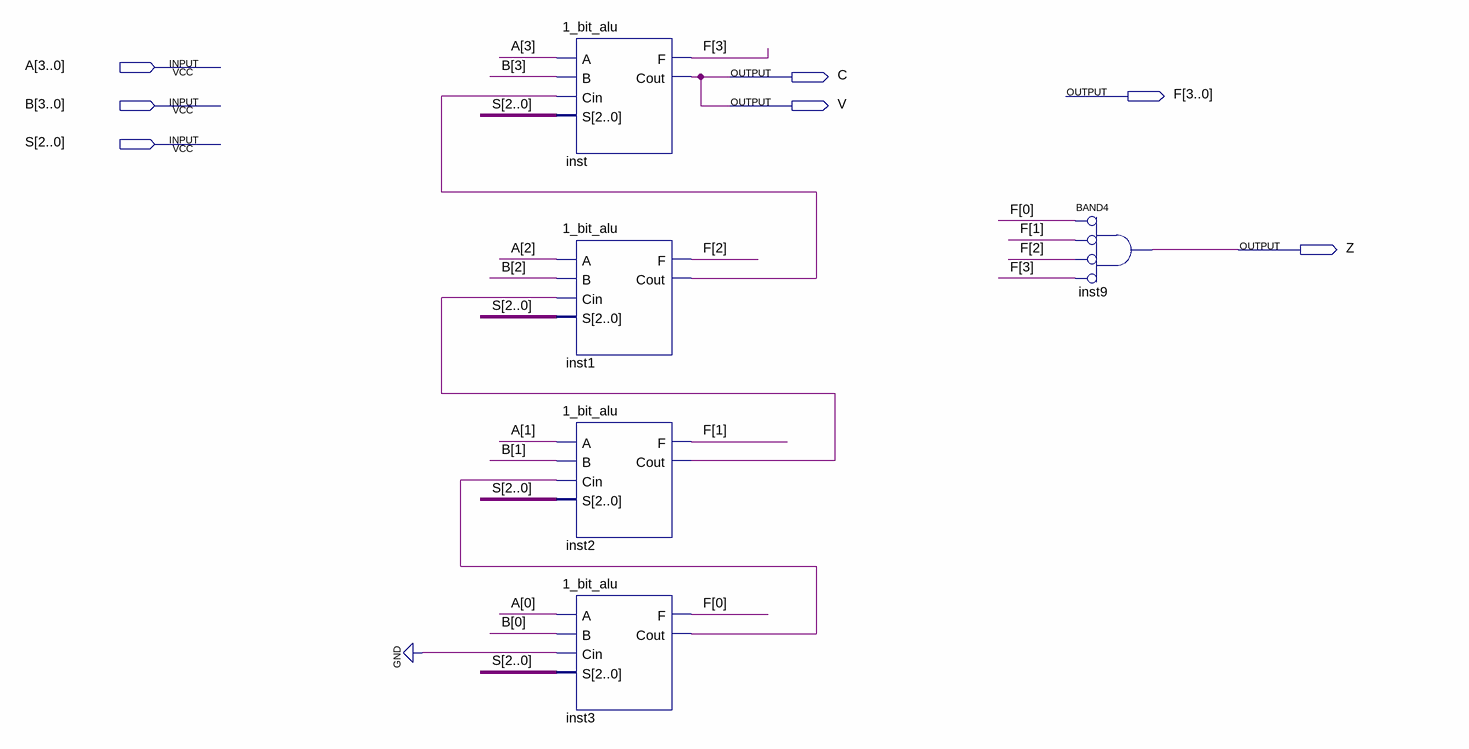
[diagram p0: schematic sheet]
// Quartus schematic alu_4bit.bdf as structural Verilog: 5 symbols, 7 pins
module alu_4bit (
  input  [3:0] A,
  input  [3:0] B,
  input  [2:0] S,
  output C,
  output [3:0] F,
  output V,
  output Z
);

  wire inst1_cout, inst2_cout, inst3_cout;

  \1_bit_alu  inst (.A(A[3]), .B(B[3]), .Cin(inst1_cout), .S(S), .F(F[3]), .Cout(C));
  \1_bit_alu  inst1 (.A(A[2]), .B(B[2]), .Cin(inst2_cout), .S(S), .F(F[2]), .Cout(inst1_cout));
  \1_bit_alu  inst2 (.A(A[1]), .B(B[1]), .Cin(inst3_cout), .S(S), .F(F[1]), .Cout(inst2_cout));
  \1_bit_alu  inst3 (.A(A[0]), .B(B[0]), .Cin(1'b0), .S(S), .F(F[0]), .Cout(inst3_cout));
  and inst9 (Z, ~F[0], ~F[1], ~F[2], ~F[3]);  // BAND4

  assign V = C;
endmodule
